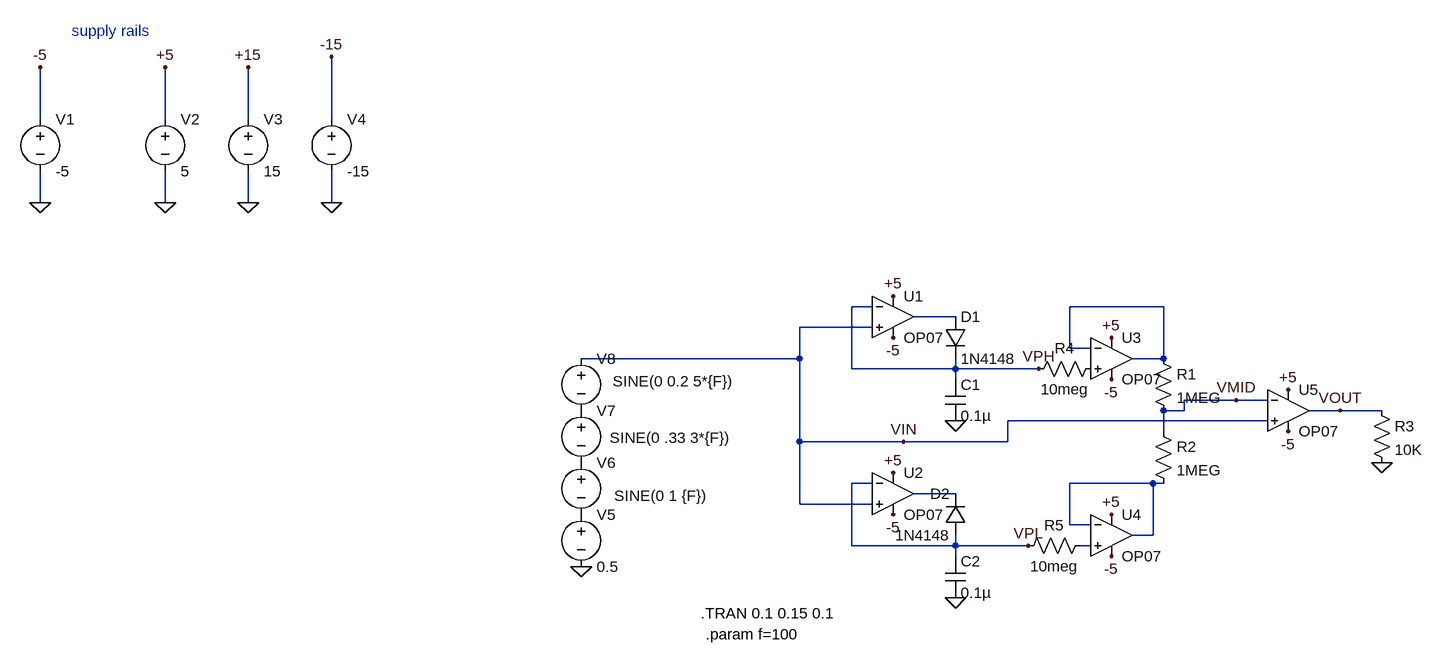
[diagram p0: schematic PLL_CONDITIONING.asc]
PLL_CONDITIONING.asc, the LTspice schematic file:
Version 4
SHEET 1 880 680
WIRE -1376 -256 -1376 -336
WIRE -1184 -256 -1184 -336
WIRE -1056 -256 -1056 -336
WIRE -928 -256 -928 -352
WIRE -1376 -128 -1376 -176
WIRE -1184 -128 -1184 -176
WIRE -1056 -128 -1056 -176
WIRE -928 -128 -928 -176
WIRE -96 32 -128 32
WIRE 352 32 208 32
WIRE 32 48 -32 48
WIRE -96 64 -208 64
WIRE 208 96 208 32
WIRE 240 96 208 96
WIRE -208 112 -208 64
WIRE -208 112 -544 112
WIRE 352 112 352 32
WIRE 352 112 304 112
WIRE -128 128 -128 32
WIRE 32 128 32 112
WIRE 32 128 -128 128
WIRE 160 128 32 128
WIRE 32 144 32 128
WIRE 464 176 384 176
WIRE 512 176 464 176
WIRE 384 192 384 176
WIRE 384 192 352 192
WIRE 624 192 576 192
WIRE 688 192 624 192
WIRE 512 208 112 208
WIRE 352 224 352 192
WIRE -208 240 -208 112
WIRE -48 240 -208 240
WIRE 112 240 112 208
WIRE 112 240 -48 240
WIRE -96 304 -128 304
WIRE 336 304 208 304
WIRE 352 304 336 304
WIRE 32 320 -32 320
WIRE -208 336 -208 240
WIRE -96 336 -208 336
WIRE 208 368 208 304
WIRE 240 368 208 368
WIRE 336 384 336 304
WIRE 336 384 304 384
WIRE -128 400 -128 304
WIRE 32 400 32 384
WIRE 32 400 -128 400
WIRE 144 400 32 400
WIRE 240 400 224 400
WIRE 32 416 32 400
FLAG -1184 -336 +5
FLAG -1376 -336 -5
FLAG -1184 -128 0
FLAG -1376 -128 0
FLAG -1056 -128 0
FLAG -928 -128 0
FLAG -1056 -336 +15
FLAG -928 -352 -15
FLAG -64 16 +5
FLAG -64 80 -5
FLAG 272 80 +5
FLAG 272 144 -5
FLAG 272 352 +5
FLAG 272 416 -5
FLAG 544 160 +5
FLAG 544 224 -5
FLAG 32 208 0
FLAG -64 288 +5
FLAG -64 352 -5
FLAG 32 480 0
FLAG -544 432 0
FLAG 688 272 0
FLAG 464 176 VMID
FLAG 160 128 VPH
FLAG 144 400 VPL
FLAG -48 240 VIN
FLAG 624 192 VOUT
SYMBOL Opamps/OP07 -64 -16 R0
SYMATTR InstName U1
SYMBOL voltage -1376 -272 R0
SYMATTR InstName V1
SYMATTR Value -5
SYMBOL voltage -1184 -272 R0
SYMATTR InstName V2
SYMATTR Value 5
SYMBOL voltage -1056 -272 R0
SYMATTR InstName V3
SYMATTR Value 15
SYMBOL voltage -928 -272 R0
SYMATTR InstName V4
SYMATTR Value -15
SYMBOL Opamps/OP07 272 48 R0
SYMATTR InstName U3
SYMBOL Opamps/OP07 272 320 R0
SYMATTR InstName U4
SYMBOL Opamps/OP07 544 128 R0
SYMATTR InstName U5
SYMBOL voltage -544 336 R0
SYMATTR InstName V5
SYMATTR Value 0.5
SYMBOL diode 16 48 R0
SYMATTR InstName D1
SYMATTR Value 1N4148
SYMBOL cap 16 144 R0
SYMATTR InstName C1
SYMATTR Value 0.1µ
SYMBOL Opamps/OP07 -64 256 R0
SYMATTR InstName U2
SYMBOL diode 48 384 R180
WINDOW 0 24 64 Left 2
WINDOW 3 24 0 Left 2
SYMATTR InstName D2
SYMATTR Value 1N4148
SYMBOL cap 16 416 R0
SYMATTR InstName C2
SYMATTR Value 0.1µ
SYMBOL res 336 96 R0
SYMATTR InstName R1
SYMATTR Value 1MEG
SYMBOL res 336 208 R0
SYMATTR InstName R2
SYMATTR Value 1MEG
SYMBOL voltage -544 256 R0
WINDOW 3 51 67 Left 2
SYMATTR InstName V6
SYMATTR Value SINE(0 1 {F})
SYMBOL voltage -544 176 R0
WINDOW 3 44 58 Left 2
SYMATTR InstName V7
SYMATTR Value SINE(0 .33 3*{F})
SYMBOL voltage -544 96 R0
WINDOW 3 49 51 Left 2
SYMATTR InstName V8
SYMATTR Value SINE(0 0.2 5*{F})
SYMBOL res 672 176 R0
SYMATTR InstName R3
SYMATTR Value 10K
SYMBOL res 256 112 R90
WINDOW 0 0 56 VBottom 2
WINDOW 3 32 56 VTop 2
SYMATTR InstName R4
SYMATTR Value 10meg
SYMBOL res 240 384 R90
WINDOW 0 0 56 VBottom 2
WINDOW 3 32 56 VTop 2
SYMATTR InstName R5
SYMATTR Value 10meg
TEXT -1328 -392 Left 2 ;supply rails
TEXT -360 504 Left 2 !.TRAN 0.1 0.15 0.1
TEXT -352 536 Left 2 !.param f=100

The netlist it stands for:
* PLL_CONDITIONING.asc
XU1 VIN VPH +5 -5 N002 LT1001  ; OP07, pins In+ In- V+ V- OUT
V1 -5 0 -5
V2 +5 0 5
V3 +15 0 15
V4 -15 0 -15
XU3 P001 N001 +5 -5 N001 LT1001  ; OP07, pins In+ In- V+ V- OUT
XU4 N005 N003 +5 -5 N003 LT1001  ; OP07, pins In+ In- V+ V- OUT
XU5 VIN VMID +5 -5 VOUT LT1001  ; OP07, pins In+ In- V+ V- OUT
V5 P002 0 0.5
D1 N002 VPH 1N4148
C1 VPH 0 0.1µ
XU2 VIN VPL +5 -5 N004 LT1001  ; OP07, pins In+ In- V+ V- OUT
D2 VPL N004 1N4148
C2 VPL 0 0.1µ
R1 N001 VMID 1MEG
R2 VMID N003 1MEG
V6 P003 P002 SINE(0 1 {F})
V7 P004 P003 SINE(0 .33 3*{F})
V8 VIN P004 SINE(0 0.2 5*{F})
R3 VOUT 0 10K
R4 P001 VPH 10meg
R5 N005 VPL 10meg
.model D D
.lib standard.dio
* supply rails
.TRAN 0.1 0.15 0.1
.param f=100
.lib LTC.lib
.backanno
.end